# EAGLE design untitled (EAGLE 9.2.2)
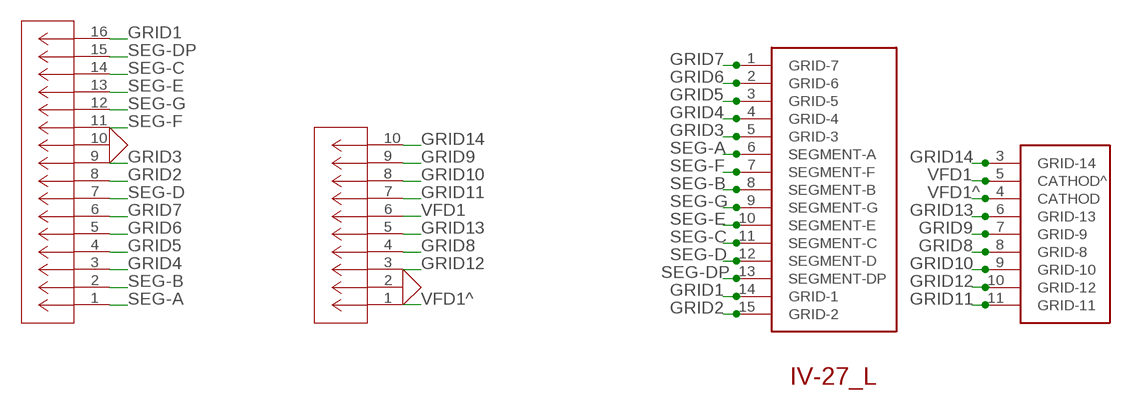
[diagram p0: schematic, sheet 1]

## Parts
IV-27_L  8-215079-6  [CONN16_8-215079-6]
IV-27_R  8-215079-0  [CONN10_8-215079-0]
U$1  IV-27_L  [IV-27_L]
U$2  IV-27_R  [IV-27_R]

## Nets
GND: IV-27_L.10 IV-27_R.2
GRID1: IV-27_L.16 U$1.14(GRID-1)
GRID2: IV-27_L.8 U$1.15(GRID-2)
GRID3: IV-27_L.9 U$1.5(GRID-3)
GRID4: IV-27_L.3 U$1.4(GRID-4)
GRID5: IV-27_L.4 U$1.3(GRID-5)
GRID6: IV-27_L.5 U$1.2(GRID-6)
GRID7: IV-27_L.6 U$1.1(GRID-7)
GRID8: IV-27_R.4 U$2.8(GRID-8)
GRID9: IV-27_R.9 U$2.7(GRID-9)
GRID10: IV-27_R.8 U$2.9(GRID-10)
GRID11: IV-27_R.7 U$2.11(GRID-11)
GRID12: IV-27_R.3 U$2.10(GRID-12)
GRID13: IV-27_R.5 U$2.6(GRID-13)
GRID14: IV-27_R.10 U$2.3(GRID-14)
SEG-A: IV-27_L.1 U$1.6(SEGMENT-A)
SEG-B: IV-27_L.2 U$1.8(SEGMENT-B)
SEG-C: IV-27_L.14 U$1.11(SEGMENT-C)
SEG-D: IV-27_L.7 U$1.12(SEGMENT-D)
SEG-DP: IV-27_L.15 U$1.13(SEGMENT-DP)
SEG-E: IV-27_L.13 U$1.10(SEGMENT-E)
SEG-F: IV-27_L.11 U$1.7(SEGMENT-F)
SEG-G: IV-27_L.12 U$1.9(SEGMENT-G)
VFD1: IV-27_R.6 U$2.5(CATHOD^)
VFD1^: IV-27_R.1 U$2.4(CATHOD)

## Library data of the parts
IV-27_L = 8-215079-6:8-215079-6; MANUFACTURER_PART_NUMBER: 82150796; VENDOR: TE Connectivity
IV-27_R = 8-215079-0:8-215079-0; MANUFACTURER_PART_NUMBER: 82150790; VENDOR: TE Connectivity
U$1 = IV-27_L:IV-27_L
U$2 = IV-27_R:IV-27_R

## Net classes
0 default: width 0.203 mm, clearance 0.254 mm

## Board
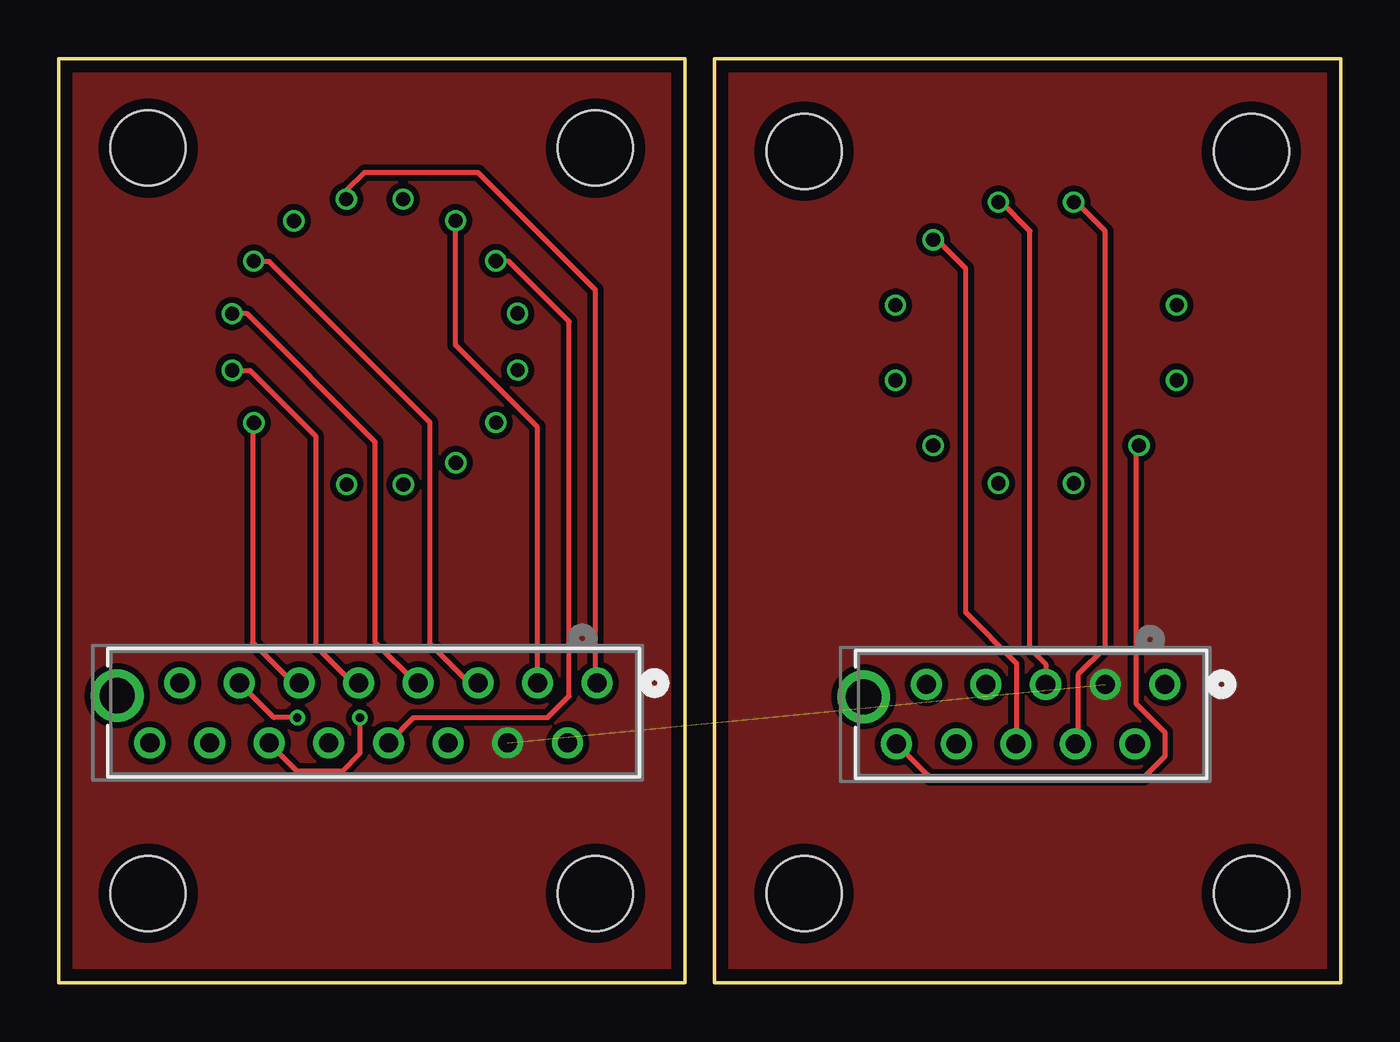
[diagram p1: board, top side]
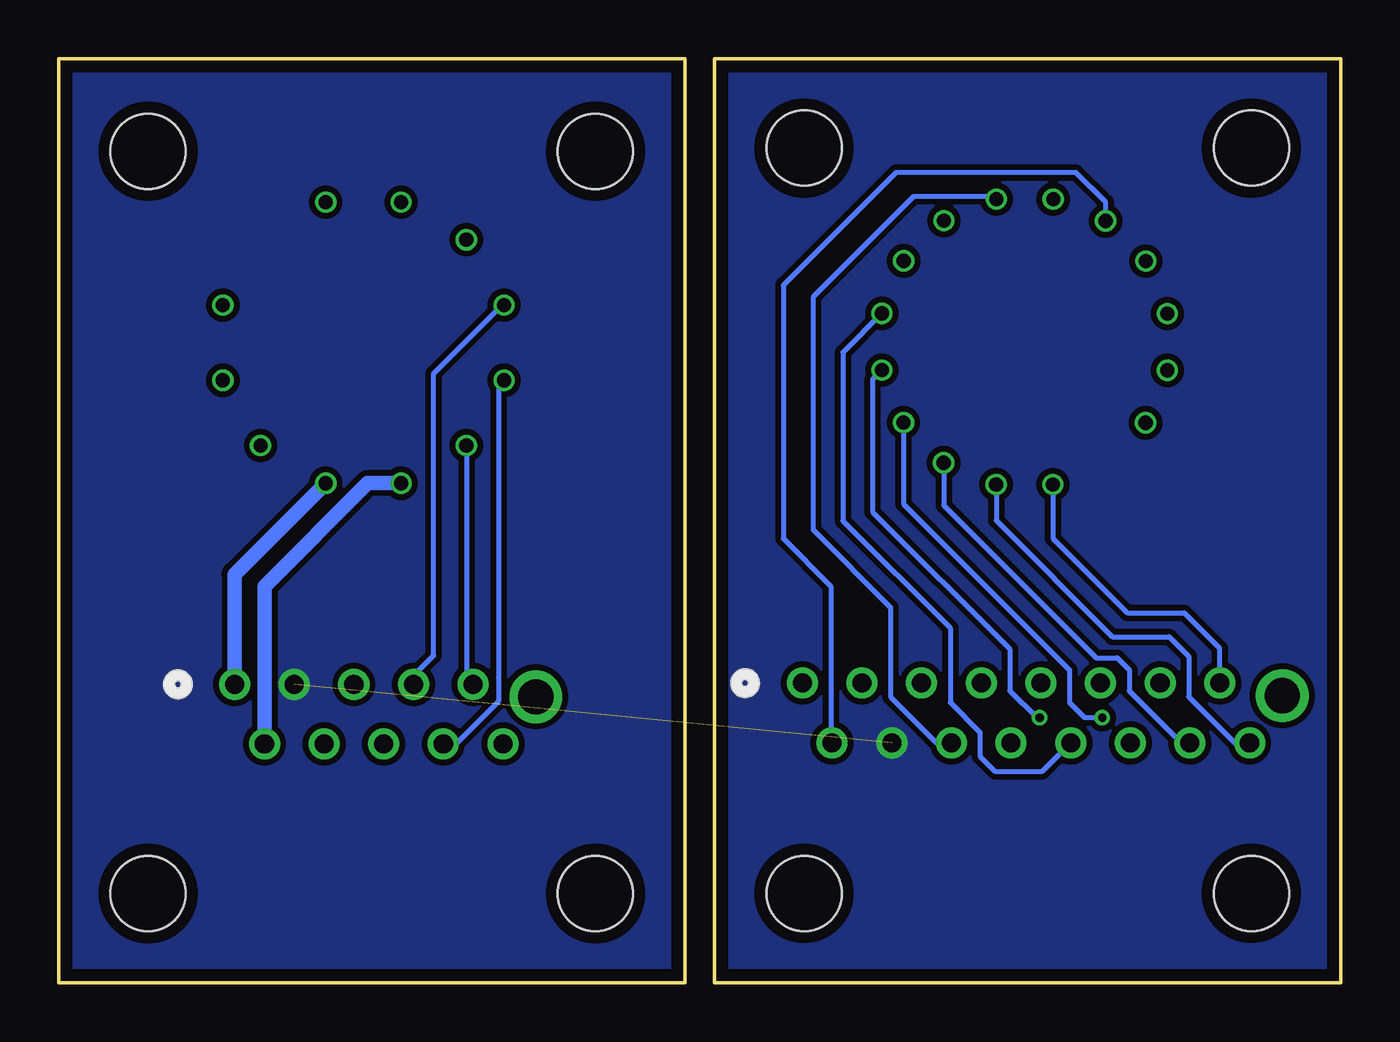
[diagram p2: board, bottom side, seen from below]

Size 54.61 x 39.37 mm. Coordinates in mm from the lower left corner, seen from the top.
Outline: 27.94,39.37 54.61,39.37 54.61,0 27.94,0 27.94,39.37
Outline: 0,0 26.67,0 26.67,39.37 0,39.37 0,0
Copper layers (1*16): Top 0.035mm / dielectric 1.6mm / Bottom 0.035mm
Design rules "Elecrow_2-layer_PCB_eagle_rule": minimum track width 6mil, minimum drill 12mil, track to track 6mil, track to pad 6mil, pad to pad 6mil, via to via 8mil, smd to smd 0mil, copper to edge 20mil, drill to drill 10mil, minimum pad ring 6mil, minimum via ring 6mil, stop-mask expansion 0mil, vias tented up to drill 100mil, thermal gap 10mil
Holes 3.2 mm at 3.81,35.56 22.86,35.56 3.81,3.81 22.86,3.81 50.8,3.81 31.75,3.81 50.8,35.43 31.75,35.43

### Footprints (pad centres in the part's own frame; a part is rotated, then mirrored left to right if it is on the bottom)
CONN16_8-215079-6 = drill 0.813 pad 1.321: 1 0.051,-0.076; 2 2.591,-0.076; 3 5.131,-0.076; 4 7.671,-0.076; 5 10.211,-0.076; 6 12.751,-0.076; 7 15.291,-0.076; 8 17.831,-0.076; 9 1.321,2.464; 10 3.861,2.464; 11 6.401,2.464; 12 8.941,2.464; 13 11.481,2.464; 14 14.021,2.464; 15 16.561,2.464; 16 19.101,2.464 | drill 1.499 pad 1.499: 17 20.498,0.457
CONN10_8-215079-0 = drill 0.813 pad 1.321: 1 0,-0.025; 2 2.54,-0.025; 3 5.08,-0.025; 4 7.62,-0.025; 5 10.16,-0.025; 6 1.27,2.515; 7 3.81,2.515; 8 6.35,2.515; 9 8.89,2.515; 10 11.43,2.515 | drill 1.499 pad 1.499: 11 12.827,0.508
IV-27_L = drill 0.6: 1 -5.149,-3.446; 2 -6.076,-1.211; 3 -6.078,1.208; 4 -5.155,3.443; 5 -3.446,5.155; 6 -1.211,6.083; 7 1.208,6.085; 8 3.443,5.161; 9 5.156,3.452; 10 6.083,1.218; 11 6.085,-1.201; 12 5.162,-3.437; 13 3.452,-5.149; 14 1.218,-6.076; 15 -1.201,-6.078
IV-27_R = drill 0.6: 1 -5.962,-1.577; 2 -5.962,1.633; 3 -4.358,4.412; 4 -1.578,6.017; 5 1.631,6.017; 6 4.411,4.412; 7 6.015,1.633; 8 6.015,-1.577; 9 4.411,-4.356; 10 1.631,-5.961; 11 -1.578,-5.961

### Placement (x,y rotation side)
IV-27_L  22.99,12.7 180 top
IV-27_R  47.12,12.7 180 top
U$1  13.46,27.3 0 top
U$2  41.66,27.3 180 top

### Tracks (layer width: path | path; a pad name or v marks a point on that pad's centre or on a via)
GND  (1 unrouted)
  pour Top (no thermals): 0,39.37 26.67,39.37 26.67,0 0,0
  pour Top (no thermals): 27.94,39.37 54.61,39.37 54.61,0 27.94,0
  pour Bottom (no thermals): 0,39.37 26.67,39.37 26.67,0 0,0
  pour Bottom (no thermals): 27.94,39.37 54.61,39.37 54.61,0 27.94,0
GRID1
  Bottom 0.203: U$1.14 14.68,19.7 9.73,14.75 7.31,14.75 6.48,13.91 6.48,12.19 4.52,10.23 IV-27_L.16
GRID2
  Bottom 0.203: U$1.15 12.26,18.94 9.09,15.76 6.67,15.76 5.16,14.24 IV-27_L.8
GRID3
  Bottom 0.203: U$1.5 10.02,33.26 11.28,34.52 18.95,34.52 23.75,29.72 23.75,18.92 21.72,16.89 21.72,10.28 IV-27_L.9
GRID4
  Top 0.203: U$1.4 8.94,30.74 15.81,23.87 15.81,14.44 17.48,12.77 IV-27_L.3
GRID5
  Top 0.203: U$1.3 8.02,28.51 13.49,23.04 13.49,14.5 15.22,12.77 IV-27_L.4
GRID6
  Top 0.203: IV-27_L.5 12.52,12.77 10.95,14.35 10.95,23.29 8.15,26.09 U$1.2
GRID7
  Top 0.203: IV-27_L.6 9.98,12.77 8.26,14.5 8.26,23.8 U$1.1
GRID8
  Bottom 0.203: U$2.8 35.72,28.88 38.63,25.96 38.63,13.95 39.32,13.26 39.32,12.8 IV-27_R.4
GRID9
  Bottom 0.203: U$2.7 35.88,25.43 35.88,13.01 35.88,13 35.88,11.98 36.4,11.46 37.68,10.18 IV-27_R.9
GRID10
  Top 0.203: U$2.9 37.41,31.66 38.63,30.43 38.63,15.77 40.79,13.61 40.79,10.21 IV-27_R.8
GRID11
  Top 0.203: U$2.11 43.35,33.26 44.58,32.03 44.58,14.3 43.43,13.16 43.43,10.29 IV-27_R.7
GRID12
  Top 0.203: U$2.10 40.15,33.26 41.38,32.03 41.38,14.22 42.06,13.54 42.06,12.8 IV-27_R.3
GRID13
  Bottom 0.203: U$2.6 37.24,12.98 36.98,12.72 IV-27_R.5
GRID14
  Top 0.203: U$2.3 45.89,22.76 45.89,11.9 47.12,10.67 47.12,9.65 46.23,8.76 37.1,8.76 IV-27_R.10
SEG-A
  Top 0.203: U$1.6 12.25,33.74 13.03,34.52 17.86,34.52 22.86,29.52 22.86,12.8 IV-27_L.1
SEG-B
  Top 0.203: IV-27_L.2 20.4,23.67 16.91,27.16 U$1.8
SEG-C  (via drill 0.35)
  Top 0.203: v12.83,11.3 12.83,9.78 12.06,9.02 10.16,9.02 8.97,10.21 IV-27_L.14
  Bottom 0.203: U$1.11 19.94,25.71 19.94,20.07 14.1,14.22 14.1,12.45 12.95,11.3 v12.83,11.3
SEG-D  (via drill 0.35)
  Top 0.203: v10.16,11.3 9.16,11.3 IV-27_L.7
  Bottom 0.203: U$1.12 18.62,20.4 11.56,13.34 11.56,11.94 10.92,11.3 v10.16,11.3
SEG-DP
  Bottom 0.203: U$1.13 16.91,20.34 10.41,13.84 9.53,13.84 9.02,13.34 9.02,12.45 6.8,10.23 IV-27_L.15
SEG-E
  Bottom 0.203: U$1.10 21.21,26.86 21.21,19.68 16.64,15.11 16.64,11.94 15.37,10.67 15.37,9.65 14.73,9.02 12.72,9.02 IV-27_L.13
SEG-F
  Bottom 0.203: U$1.7 14.79,33.51 18.18,33.51 22.48,29.21 22.48,19.3 19.18,16 19.18,12.19 17.22,10.23 IV-27_L.11
SEG-G
  Top 0.203: U$1.9 19.16,30.75 21.74,28.17 21.74,12.22 20.83,11.3 15.12,11.3 IV-27_L.12
VFD1
  Bottom 0.61: U$2.5 41.45,21.28 45.85,16.89 IV-27_R.6
VFD1^
  Bottom 0.61: U$2.4 47.12,17.4 IV-27_R.1